# EasyEDA schematic RC car.json
TITLE: Sheet_1; REV: 1.0; Date: 2024-11-14; Sheet: 1/1; Drawn By: dutu2019; Company: Your Company
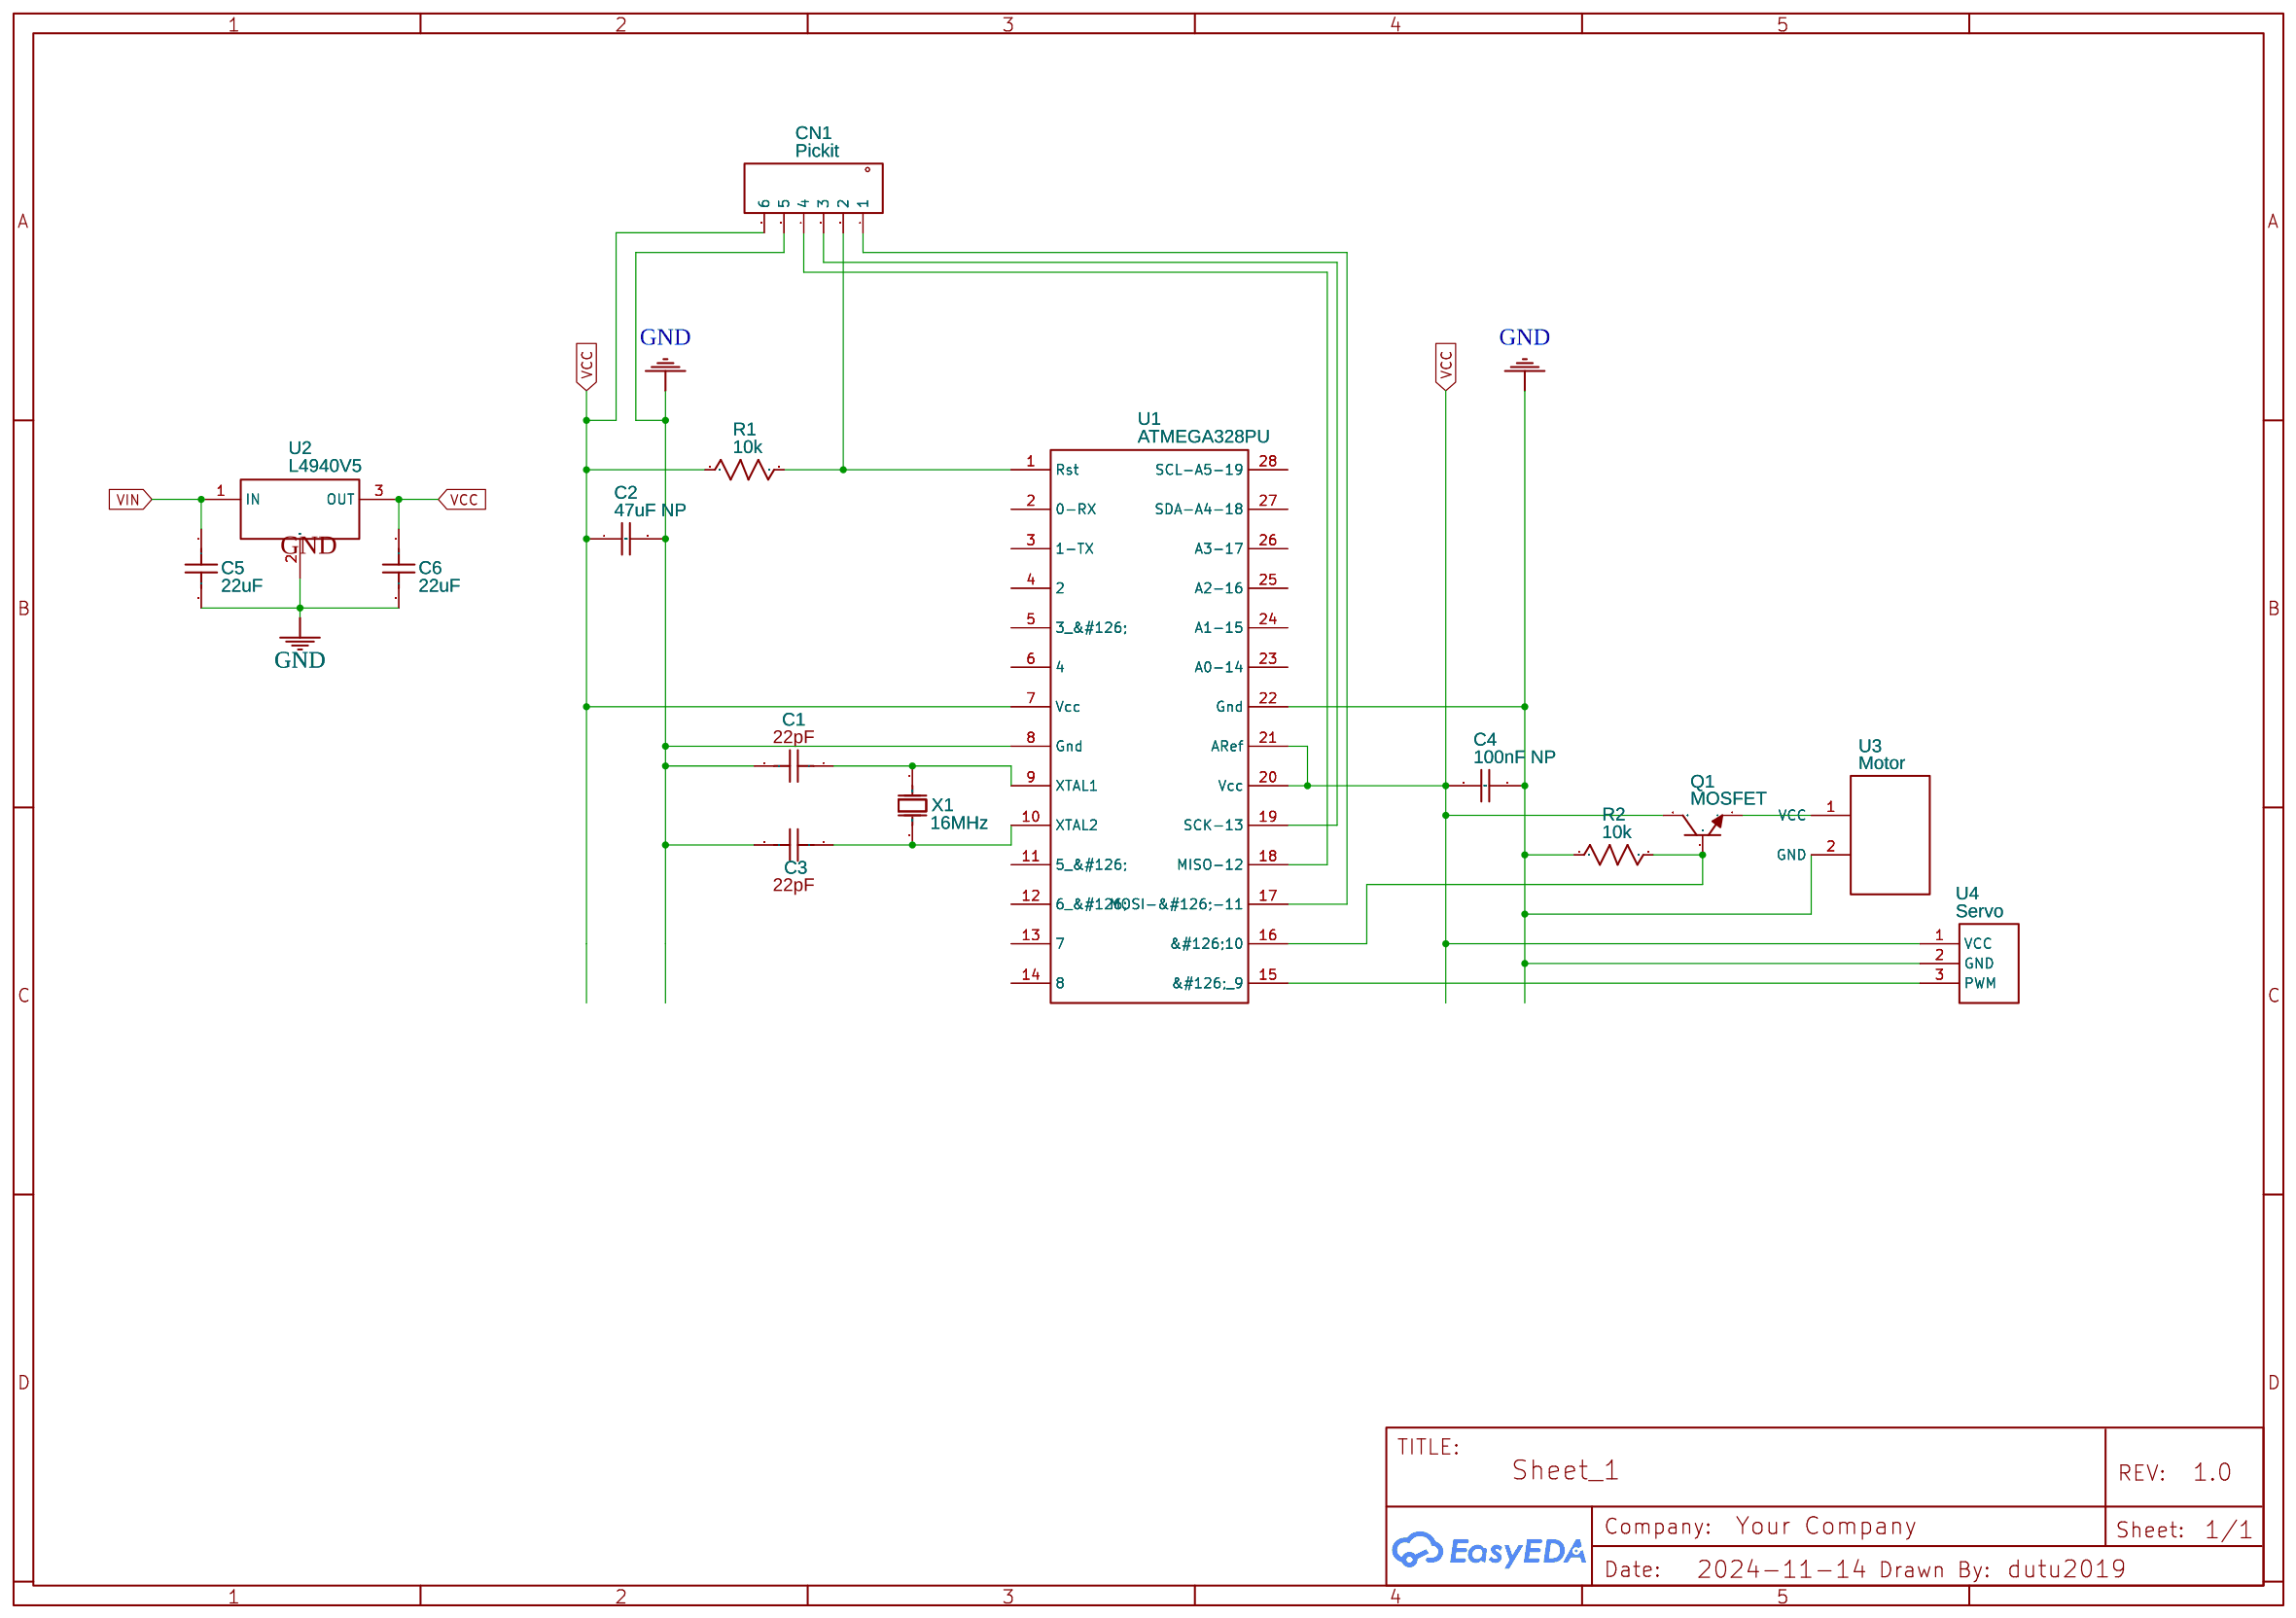
[diagram p0: schematic sheet]

## Parts
C1  22pF Ceramic Capacitor  [GENCERAMICCAPACITOR]
C2  47uF NP  [THT NON-POLARIZED CAPACITOR [1] 1 CIRCULAR]
C3  22pF Ceramic Capacitor  [GENCERAMICCAPACITOR]
C4  100nF NP  [THT NON-POLARIZED CAPACITOR [1] 1 CIRCULAR]
C5  22uF  [C0603]
C6  22uF  [C0603]
CN1  Pickit  [PINHEADER-6PIN]
Q1  MOSFET  [SOT-23-3_L2.9-W1.3-P1.90-LS2.4-TR]
R1  10k  [R0603]
R2  10k  [R0603]
U1  ATMEGA328PU  [ATMEGA328PU]
U2  L4940V5  [TO-220-3_L10.0-W4.5-P2.54-T]
U3  Motor  [2-PIN HEADER]
U4  Servo  [3-PIN HEADER]
X1  16MHz  [CRISTAL]

## Library data of the parts
C1 C3 = 22pF Ceramic Capacitor: Contributor: Giann De Leon
C2 C4 = 104 Non-Polarized Capacitor [1] 1: Contributor: FREDENTER_Projects
C5 C6 = C_0603_US: Contributor: LCEDA_Lib
CN1 = PINHEADER-6PIN6: Contributor: tiennguyenanh1
Q1 = 2N3904(SOT-23): Supplier: LCSC; Manufacturer: KEC; Manufacturer Part: 2n3904S-RTK/PS; Supplier Part: C18536; Paste Type: SOT-23; Contributor: LCEDA_Lib
R1 R2 = R_0603_US: Contributor: LCEDA_Lib
U1 = ATMEGA328PU: Contributor: udayjagan16392
U2 = L4940V5: Supplier: LCSC; Manufacturer: ST(意法半导体); Supplier Part: C92218; JLCPCB Part Class: Extended Part
U3 = 2-pin header: Contributor: dutu2019
U4 = 3-PIN HEADER: Contributor: dutu2019
X1 = CRISTAL_16MHZ COPY: Supplier Part: 2819276; Supplier: Element14; Manufacturer: TXC; Manufacturer Part: 9B-48.000MAAE-B; Contributor: DFerrari

## Nets
GND: C1.2 C2.2 C3.2 C4.2 C5.2 C6.2 CN1.5 R2.1 U1.8(Gnd) U1.22(Gnd) U2.2(GND) U4.2(GND)
VCC: C2.1 C4.1 C6.1 CN1.6 Q1.3(C) R1.1 U1.7(Vcc) U1.20(Vcc) U1.21(ARef) U2.3(OUT) U4.1(VCC)
VIN: C5.1 U2.1(IN)
Net-(C1-1): C1.1 U1.9(XTAL1) X1.1(OSC1)
Net-(C3-1): C3.1 U1.10(XTAL2) X1.2(OSC2)
Net-(CN1-1): CN1.1 U1.17(MOSI-&#126;-11)
Net-(CN1-2): CN1.2 R1.2 U1.1(Rst)
Net-(CN1-3): CN1.3 U1.19(SCK-13)
Net-(CN1-4): CN1.4 U1.18(MISO-12)
Net-(Q1-1): Q1.1(E) U3.1(VCC)
Net-(Q1-2): Q1.2(B) R2.2 U1.16(&#126;10)
Net-(U1-15): U1.15(&#126; 9) U4.3(PWM)

Not connected (* = marked no-connect by the designer): U1 2(0-RX) 3(1-TX) 4(2) 5(3 &#126;) 6(4) 11(5 &#126;) 12(6 &#126;) 13(7) 14(8) 23(A0-14) 24(A1-15) 25(A2-16) 26(A3-17) 27(SDA-A4-18) 28(SCL-A5-19); U3 2(GND)
